# EAGLE schematic PA3 (EAGLE 7.7.0)
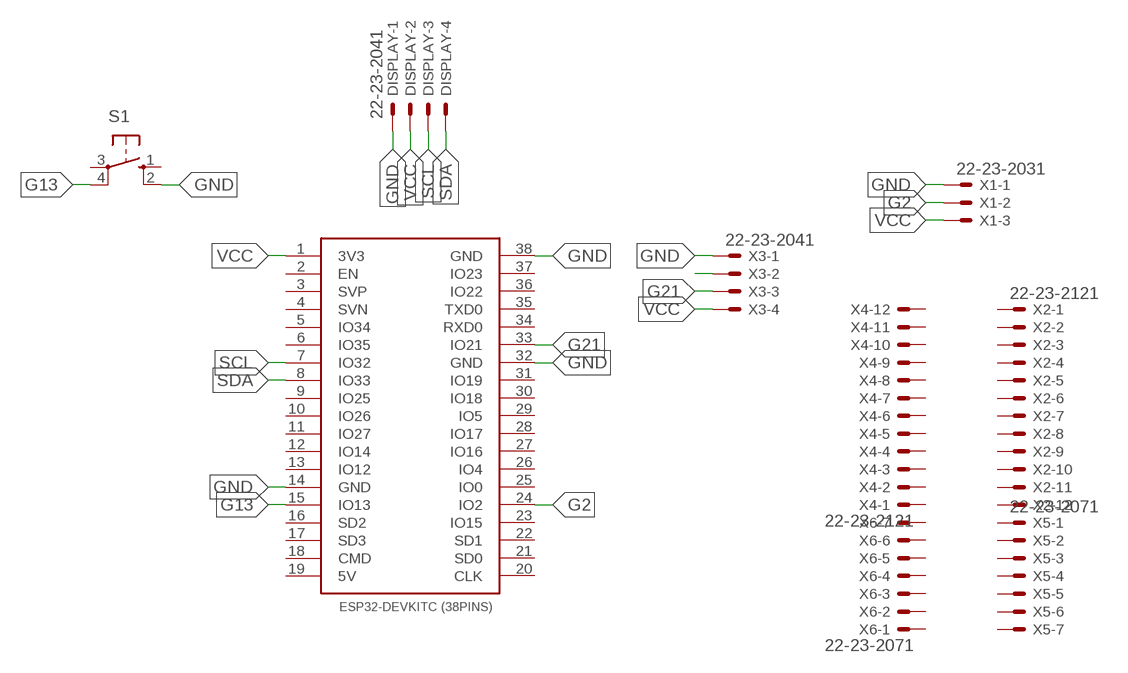
[diagram p0: schematic, sheet 1]

## Parts
DISPLAY  22-23-2041  [22-23-2041]
ESP32-DEVKITC(38PINS)1  ESP32DEVKITC_38PINS  [ESP32-DEVKITC]
S1  10-XX  [B3F-10XX]
X1  22-23-2031  [22-23-2031]
X2  22-23-2121  [22-23-2121]
X3  22-23-2041  [22-23-2041]
X4  22-23-2121  [22-23-2121]
X5  22-23-2071  [22-23-2071]
X6  22-23-2071  [22-23-2071]

## Nets
G2: ESP32-DEVKITC(38PINS)1.24(IO2) X1.2
G13: ESP32-DEVKITC(38PINS)1.15(IO13) S1.4(P1)
G21: ESP32-DEVKITC(38PINS)1.33(IO21) X3.3
GND: DISPLAY.1 ESP32-DEVKITC(38PINS)1.14(GND) ESP32-DEVKITC(38PINS)1.32(GND) ESP32-DEVKITC(38PINS)1.38(GND) S1.2(S1) X1.1 X3.1
N$3: X3.2
SCL: DISPLAY.3 ESP32-DEVKITC(38PINS)1.7(IO32)
SDA: DISPLAY.4 ESP32-DEVKITC(38PINS)1.8(IO33)
VCC: DISPLAY.2 ESP32-DEVKITC(38PINS)1.1(3V3) X1.3 X3.4
Unconnected: ESP32-DEVKITC(38PINS)1.2(EN) ESP32-DEVKITC(38PINS)1.3(SVP) ESP32-DEVKITC(38PINS)1.4(SVN) ESP32-DEVKITC(38PINS)1.5(IO34) ESP32-DEVKITC(38PINS)1.6(IO35) ESP32-DEVKITC(38PINS)1.9(IO25) ESP32-DEVKITC(38PINS)1.10(IO26) ESP32-DEVKITC(38PINS)1.11(IO27) ESP32-DEVKITC(38PINS)1.12(IO14) ESP32-DEVKITC(38PINS)1.13(IO12) ESP32-DEVKITC(38PINS)1.16(SD2) ESP32-DEVKITC(38PINS)1.17(SD3) ESP32-DEVKITC(38PINS)1.18(CMD) ESP32-DEVKITC(38PINS)1.19(5V) ESP32-DEVKITC(38PINS)1.20(CLK) ESP32-DEVKITC(38PINS)1.21(SD0) ESP32-DEVKITC(38PINS)1.22(SD1) ESP32-DEVKITC(38PINS)1.23(IO15) ESP32-DEVKITC(38PINS)1.25(IO0) ESP32-DEVKITC(38PINS)1.26(IO4) ESP32-DEVKITC(38PINS)1.27(IO16) ESP32-DEVKITC(38PINS)1.28(IO17) ESP32-DEVKITC(38PINS)1.29(IO5) ESP32-DEVKITC(38PINS)1.30(IO18) ESP32-DEVKITC(38PINS)1.31(IO19) ESP32-DEVKITC(38PINS)1.34(RXD0) ESP32-DEVKITC(38PINS)1.35(TXD0) ESP32-DEVKITC(38PINS)1.36(IO22) ESP32-DEVKITC(38PINS)1.37(IO23) S1.1(S) S1.3(P) X2.1 X2.2 X2.3 X2.4 X2.5 X2.6 X2.7 X2.8 X2.9 X2.10 X2.11 X2.12 X4.1 X4.2 X4.3 X4.4 X4.5 X4.6 X4.7 X4.8 X4.9 X4.10 X4.11 X4.12 X5.1 X5.2 X5.3 X5.4 X5.5 X5.6 X5.7 X6.1 X6.2 X6.3 X6.4 X6.5 X6.6 X6.7

## Library data of the parts
DISPLAY X3 = con-molex:22-23-2041: .100" (2.54mm) Center Header - 4 Pin; MF: MOLEX; MPN: 22-23-2041; OC_FARNELL: 1462920; OC_NEWARK: 38C0355
ESP32-DEVKITC(38PINS)1 = ESP32-DEVKITC(38PINS):ESP32DEVKITC
S1 = switch-omron:10-XX: OMRON SWITCH; MPN: B3F-1000; OC_FARNELL: 176432; OC_NEWARK: 36M3542
X1 = con-molex:22-23-2031: .100" (2.54mm) Center Header - 3 Pin; MF: MOLEX; MPN: 22-23-2031; OC_FARNELL: 1462950; OC_NEWARK: 30C0862
X2 X4 = con-molex:22-23-2121: .100" (2.54mm) Center Header - 12 Pin; MF: MOLEX; MPN: 22-23-2121; OC_FARNELL: 1462935; OC_NEWARK: 56H0456
X5 X6 = con-molex:22-23-2071: .100" (2.54mm) Center Header - 7 Pin; MF: MOLEX; MPN: 22-23-2071; OC_FARNELL: 1654534; OC_NEWARK: 56H0445